# Altium schematic sheet Top Level.SchDoc
size B
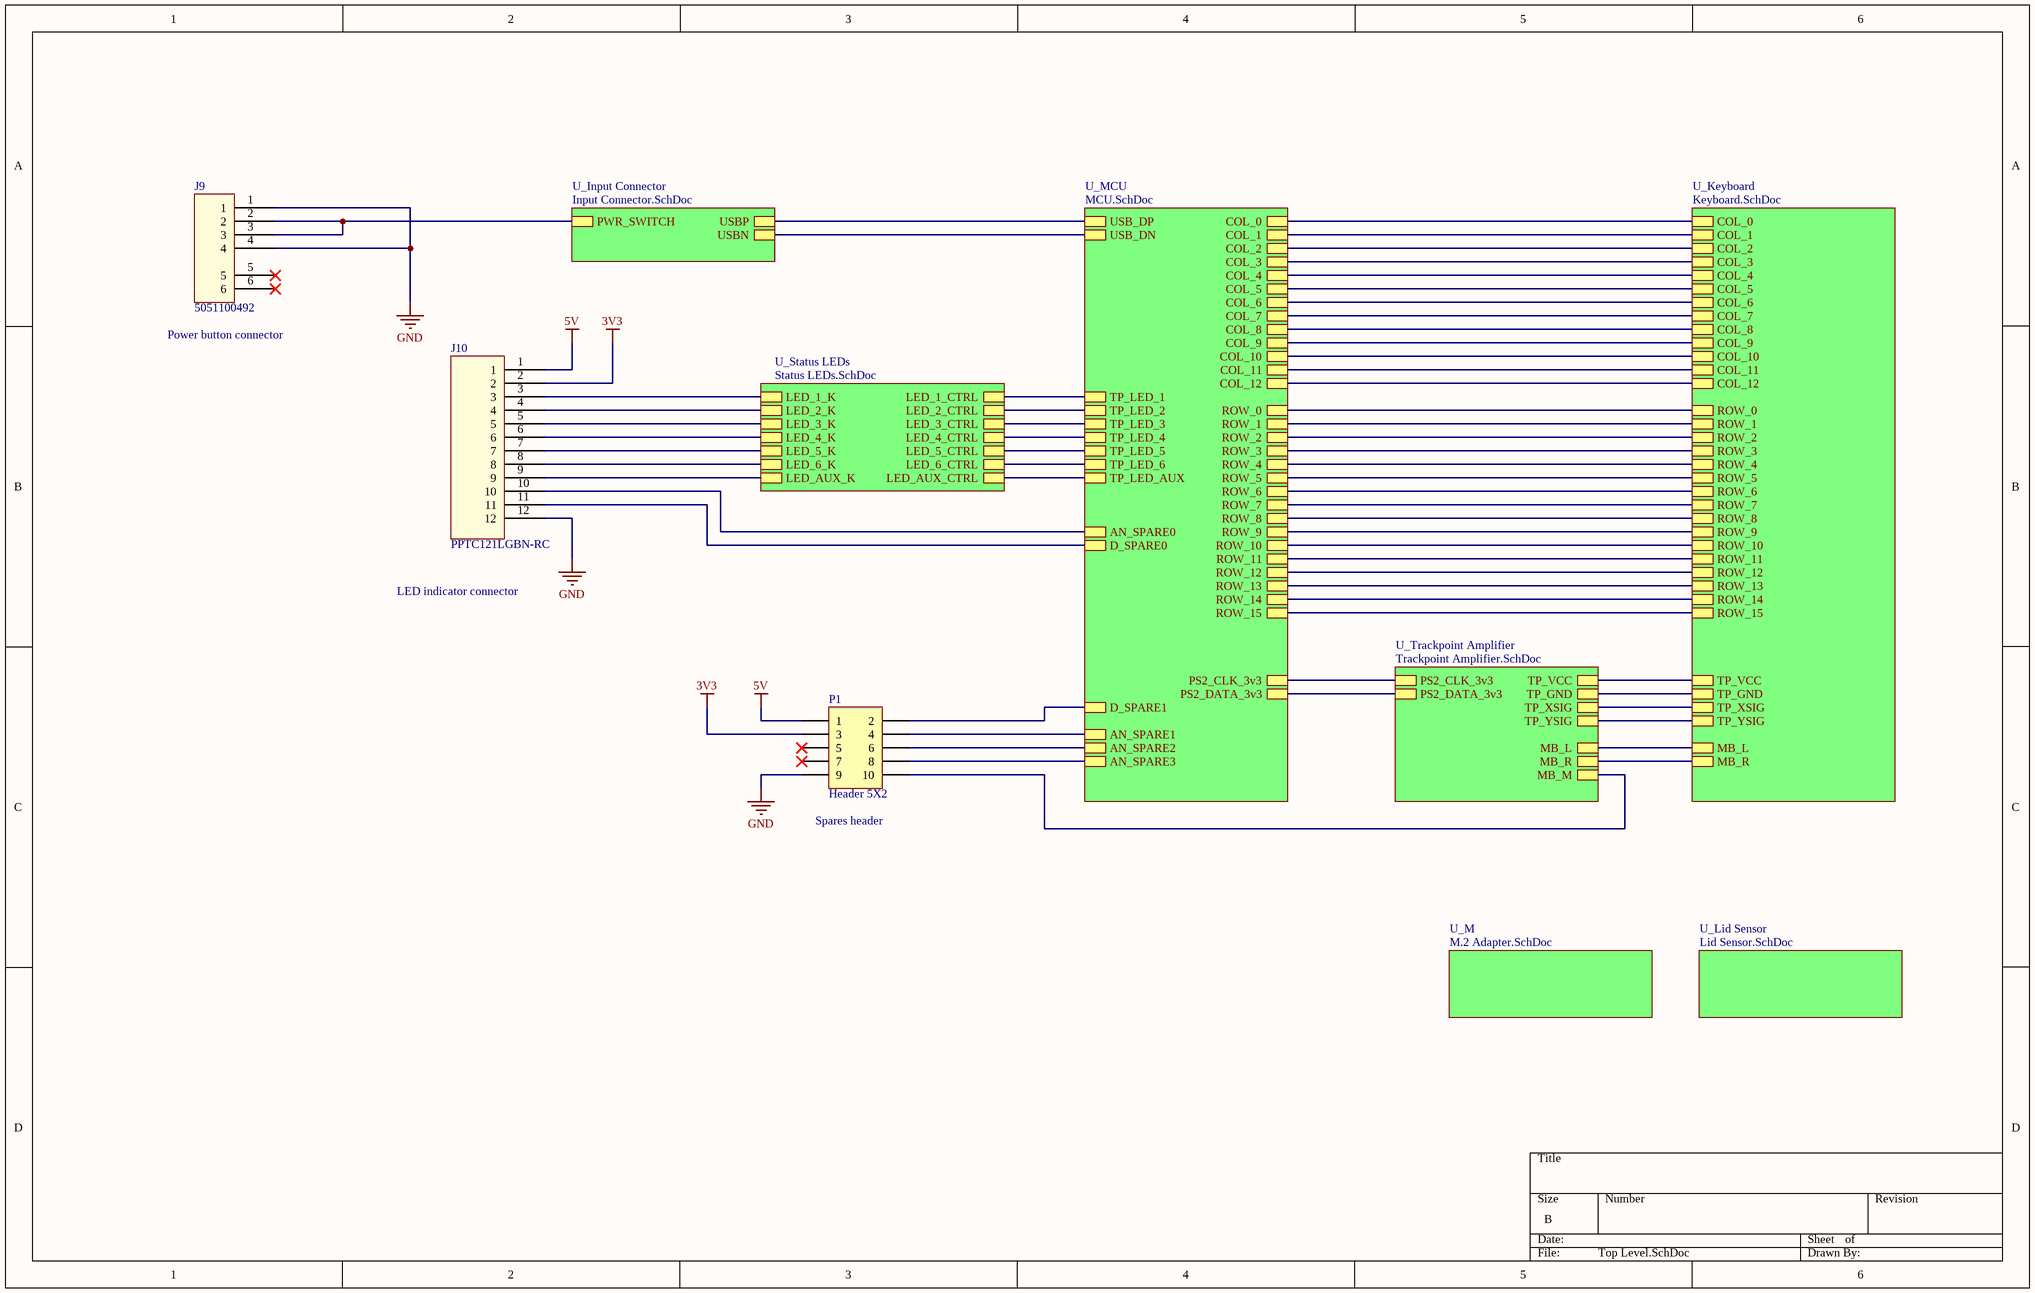
[diagram p0: Top Level.SchDoc]

## Parts
J9  5051100492  [5051100492]
J10  PPTC121LGBN-RC  [PPTC121LGBN-RC]
P1  Header 5X2  [HDR2X5]

## Sub-sheets
U_Input Connector = Input Connector.SchDoc: USBN, USBP, PWR_SWITCH
U_Keyboard = Keyboard.SchDoc: MB_L, MB_R, COL_1, COL_2, COL_3, COL_4, COL_5, COL_6, COL_7, COL_8, COL_9, COL_10, COL_11, COL_12, COL_0, ROW_1, ROW_2, ROW_3, ROW_4, ROW_5, ROW_6, ROW_7, ROW_0, ROW_9, ROW_10, ROW_11, ROW_12, ROW_13, ROW_14, ROW_15, ROW_8, TP_GND, TP_XSIG, TP_YSIG, TP_VCC
U_Lid Sensor = Lid Sensor.SchDoc: no entries
U_M = M.2 Adapter.SchDoc: no entries
U_MCU = MCU.SchDoc: USB_DP, USB_DN, AN_SPARE2, AN_SPARE1, TP_LED_1, TP_LED_2, TP_LED_3, TP_LED_4, TP_LED_5, TP_LED_6, COL_1, COL_2, COL_3, COL_4, COL_5, COL_6, COL_7, COL_8, COL_9, COL_10, COL_11, COL_12, COL_0, ROW_1, ROW_2, ROW_3, ROW_4, ROW_5, ROW_6, ROW_7, ROW_0, ROW_9, ROW_10, ROW_11, ROW_12, ROW_13, ROW_14, ROW_15, ROW_8, PS2_CLK_3v3, PS2_DATA_3v3, TP_LED_AUX, D_SPARE0, D_SPARE1, AN_SPARE0, AN_SPARE3
U_Status LEDs = Status LEDs.SchDoc: LED_1_CTRL, LED_1_K, LED_2_CTRL, LED_2_K, LED_3_CTRL, LED_3_K, LED_4_CTRL, LED_4_K, LED_5_CTRL, LED_5_K, LED_6_CTRL, LED_6_K, LED_AUX_CTRL, LED_AUX_K
U_Trackpoint Amplifier = Trackpoint Amplifier.SchDoc: TP_VCC, TP_GND, TP_XSIG, TP_YSIG, PS2_DATA_3v3, PS2_CLK_3v3, MB_M, MB_R, MB_L

## Nets
3V3: J10.2 P1.3
5V: J10.1 P1.1
GND: J9.1 J9.4 J10.12 P1.9
NetJ9_2: J9.2 J9.3 ; sheet U_Input Connector/PWR_SWITCH
NetJ10_3: J10.3 ; sheet U_Status LEDs/LED_1_K
NetJ10_4: J10.4 ; sheet U_Status LEDs/LED_2_K
NetJ10_5: J10.5 ; sheet U_Status LEDs/LED_3_K
NetJ10_6: J10.6 ; sheet U_Status LEDs/LED_4_K
NetJ10_7: J10.7 ; sheet U_Status LEDs/LED_5_K
NetJ10_8: J10.8 ; sheet U_Status LEDs/LED_6_K
NetJ10_9: J10.9 ; sheet U_Status LEDs/LED_AUX_K
NetJ10_10: J10.10 ; sheet U_MCU/AN_SPARE0
NetJ10_11: J10.11 ; sheet U_MCU/D_SPARE0
NetP1_2: P1.2 ; sheet U_MCU/D_SPARE1
NetP1_4: P1.4 ; sheet U_MCU/AN_SPARE1
NetP1_6: P1.6 ; sheet U_MCU/AN_SPARE2
NetP1_8: P1.8 ; sheet U_MCU/AN_SPARE3
NetP1_10: P1.10 ; sheet U_Trackpoint Amplifier/MB_M
(unnamed): sheet U_Input Connector/USBN, sheet U_MCU/USB_DN
(unnamed): sheet U_Input Connector/USBP, sheet U_MCU/USB_DP
(unnamed): sheet U_Keyboard/MB_L, sheet U_Trackpoint Amplifier/MB_L
(unnamed): sheet U_Keyboard/MB_R, sheet U_Trackpoint Amplifier/MB_R
(unnamed): sheet U_Keyboard/COL_1, sheet U_MCU/COL_1
(unnamed): sheet U_Keyboard/COL_2, sheet U_MCU/COL_2
(unnamed): sheet U_Keyboard/COL_3, sheet U_MCU/COL_3
(unnamed): sheet U_Keyboard/COL_4, sheet U_MCU/COL_4
(unnamed): sheet U_Keyboard/COL_5, sheet U_MCU/COL_5
(unnamed): sheet U_Keyboard/COL_6, sheet U_MCU/COL_6
(unnamed): sheet U_Keyboard/COL_7, sheet U_MCU/COL_7
(unnamed): sheet U_Keyboard/COL_8, sheet U_MCU/COL_8
(unnamed): sheet U_Keyboard/COL_9, sheet U_MCU/COL_9
(unnamed): sheet U_Keyboard/COL_10, sheet U_MCU/COL_10
(unnamed): sheet U_Keyboard/COL_11, sheet U_MCU/COL_11
(unnamed): sheet U_Keyboard/COL_12, sheet U_MCU/COL_12
(unnamed): sheet U_Keyboard/COL_0, sheet U_MCU/COL_0
(unnamed): sheet U_Keyboard/ROW_1, sheet U_MCU/ROW_1
(unnamed): sheet U_Keyboard/ROW_2, sheet U_MCU/ROW_2
(unnamed): sheet U_Keyboard/ROW_3, sheet U_MCU/ROW_3
(unnamed): sheet U_Keyboard/ROW_4, sheet U_MCU/ROW_4
(unnamed): sheet U_Keyboard/ROW_5, sheet U_MCU/ROW_5
(unnamed): sheet U_Keyboard/ROW_6, sheet U_MCU/ROW_6
(unnamed): sheet U_Keyboard/ROW_7, sheet U_MCU/ROW_7
(unnamed): sheet U_Keyboard/ROW_0, sheet U_MCU/ROW_0
(unnamed): sheet U_Keyboard/ROW_9, sheet U_MCU/ROW_9
(unnamed): sheet U_Keyboard/ROW_10, sheet U_MCU/ROW_10
(unnamed): sheet U_Keyboard/ROW_11, sheet U_MCU/ROW_11
(unnamed): sheet U_Keyboard/ROW_12, sheet U_MCU/ROW_12
(unnamed): sheet U_Keyboard/ROW_13, sheet U_MCU/ROW_13
(unnamed): sheet U_Keyboard/ROW_14, sheet U_MCU/ROW_14
(unnamed): sheet U_Keyboard/ROW_15, sheet U_MCU/ROW_15
(unnamed): sheet U_Keyboard/ROW_8, sheet U_MCU/ROW_8
(unnamed): sheet U_Keyboard/TP_GND, sheet U_Trackpoint Amplifier/TP_GND
(unnamed): sheet U_Keyboard/TP_XSIG, sheet U_Trackpoint Amplifier/TP_XSIG
(unnamed): sheet U_Keyboard/TP_YSIG, sheet U_Trackpoint Amplifier/TP_YSIG
(unnamed): sheet U_Keyboard/TP_VCC, sheet U_Trackpoint Amplifier/TP_VCC
(unnamed): sheet U_MCU/TP_LED_1, sheet U_Status LEDs/LED_1_CTRL
(unnamed): sheet U_MCU/TP_LED_2, sheet U_Status LEDs/LED_2_CTRL
(unnamed): sheet U_MCU/TP_LED_3, sheet U_Status LEDs/LED_3_CTRL
(unnamed): sheet U_MCU/TP_LED_4, sheet U_Status LEDs/LED_4_CTRL
(unnamed): sheet U_MCU/TP_LED_5, sheet U_Status LEDs/LED_5_CTRL
(unnamed): sheet U_MCU/TP_LED_6, sheet U_Status LEDs/LED_6_CTRL
(unnamed): sheet U_MCU/PS2_CLK_3v3, sheet U_Trackpoint Amplifier/PS2_CLK_3v3
(unnamed): sheet U_MCU/PS2_DATA_3v3, sheet U_Trackpoint Amplifier/PS2_DATA_3v3
(unnamed): sheet U_MCU/TP_LED_AUX, sheet U_Status LEDs/LED_AUX_CTRL

Not connected (* = marked no-connect by the designer): J9 5* 6*; P1 5* 7*

## Notes on the sheet
- (near J9) Power button connector
- LED indicator connector
- (near P1) Spares header

## Library data of the parts
J9 = 5051100492: CONN FPC BOTTOM 4POS .5MM R/A
J10 = PPTC121LGBN-RC: CONN HDR 12POS 0.1 TIN PCB R/A
P1 = Header 5X2: Header, 5-Pin, Dual row; LatestRevisionDate: 17-Jul-2002; LatestRevisionNote: Re-released for DXP Platform.; Publisher: Altium Limited